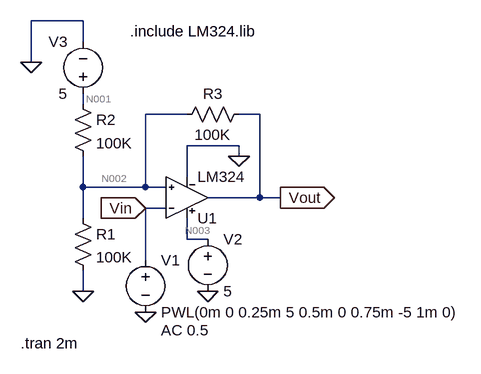
[diagram p0: schematic lab2_b.asc]
lab2_b.asc, the LTspice schematic file:
Version 4.1
SHEET 1 880 680
WIRE -64 -128 -144 -128
WIRE -64 -96 -64 -128
WIRE -144 -64 -144 -128
WIRE -64 0 -64 -16
WIRE 96 16 32 16
WIRE 208 16 176 16
WIRE 176 64 96 64
WIRE 176 80 176 64
WIRE 96 112 96 64
WIRE -64 128 -64 80
WIRE 32 128 32 16
WIRE 32 128 -64 128
WIRE 64 128 32 128
WIRE 208 144 208 16
WIRE 208 144 128 144
WIRE 240 144 208 144
WIRE 64 160 32 160
WIRE -64 176 -64 128
WIRE 96 208 96 176
WIRE 128 208 96 208
WIRE 32 240 32 160
WIRE -64 288 -64 256
FLAG 32 320 0
FLAG -64 288 0
FLAG 176 80 0
FLAG 240 144 Vout
IOPIN 240 144 Out
FLAG 128 288 0
FLAG -144 -64 0
FLAG 32 160 Vin
IOPIN 32 160 In
SYMBOL LM324 96 144 M180
SYMATTR InstName U1
SYMBOL voltage 32 224 R0
WINDOW 123 24 124 Left 2
WINDOW 39 0 0 Left 0
SYMATTR Value2 AC 0.5
SYMATTR InstName V1
SYMATTR Value PWL(0m 0 0.25m 5 0.5m 0 0.75m -5 1m 0)
SYMBOL res -80 160 R0
SYMATTR InstName R1
SYMATTR Value 100K
SYMATTR SpiceLine tol=1 pwr=0.1
SYMBOL res -80 -16 R0
SYMATTR InstName R2
SYMATTR Value 100K
SYMATTR SpiceLine tol=1 pwr=0.1
SYMBOL res 192 0 R90
WINDOW 0 0 56 VBottom 2
WINDOW 3 32 56 VTop 2
SYMATTR InstName R3
SYMATTR Value 100K
SYMATTR SpiceLine tol=1 pwr=0.1
SYMBOL voltage 128 192 R0
WINDOW 123 0 0 Left 0
WINDOW 39 0 0 Left 0
SYMATTR InstName V2
SYMATTR Value 5
SYMBOL voltage -64 0 R180
WINDOW 0 24 96 Left 2
WINDOW 3 24 16 Left 2
WINDOW 123 0 0 Left 0
WINDOW 39 0 0 Left 0
SYMATTR InstName V3
SYMATTR Value 5
TEXT 8 -112 Left 2 !.include LM324.lib
TEXT -160 368 Left 2 !.tran 2m

The netlist it stands for:
* lab2_b.asc
X§U1 N002 Vin N003 0 Vout LM324  ; pins In+ In- V+ V- OUT
V1 Vin 0 PWL(0m 0 0.25m 5 0.5m 0 0.75m -5 1m 0) AC 0.5
R1 N002 0 100K tol=1 pwr=0.1
R2 N001 N002 100K tol=1 pwr=0.1
R3 Vout N002 100K tol=1 pwr=0.1
V2 N003 0 5
V3 N001 0 5
.include LM324.lib
.tran 2m
.backanno
.end

* Results of the author's LTspice run, read from the files saved beside the schematic
* Operating Point, zero values left out:
*   V(vout) = 3.675 V
*   V(n001) = 5 V
*   V(n002) = 2.893 V
*   V(n003) = 5 V
*   I(R3) = 7.828 µA
*   I(R1) = 28.93 µA
*   I(V2) = -251.3 µA
*   I(V1) = 83.85 nA
*   I(R2) = 21.07 µA
*   I(V3) = -21.07 µA
*   Ix(u1:in+) = -26.32 nA
*   Ix(u1:in-) = -83.85 nA
*   Ix(u1:vcc) = 251.3 µA
*   Ix(u1:vss) = -243.3 µA
*   Ix(u1:out) = -7.828 µA
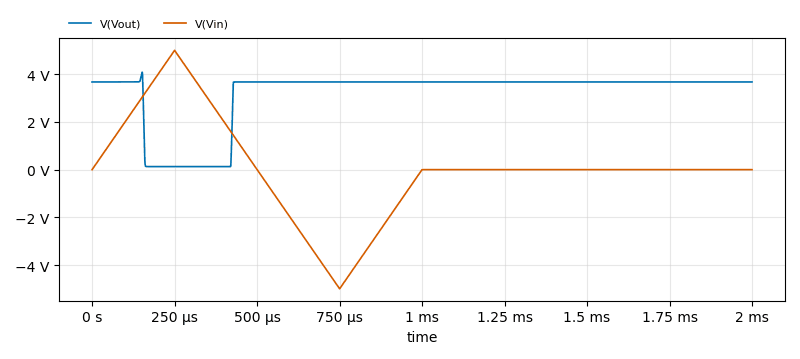
[diagram p1: Transient Analysis of lab2_b.asc, plotted from the saved traces]
* Transient Analysis, 1 run:
*   V(Vout): min 126.9 mV, max 4.086 V, average 3.202 V, rms 3.42 V, last 3.675 V
*   V(Vin): min -4.996 V, max 5 V, average 273.2 µV, rms 2.103 V, last 0 V